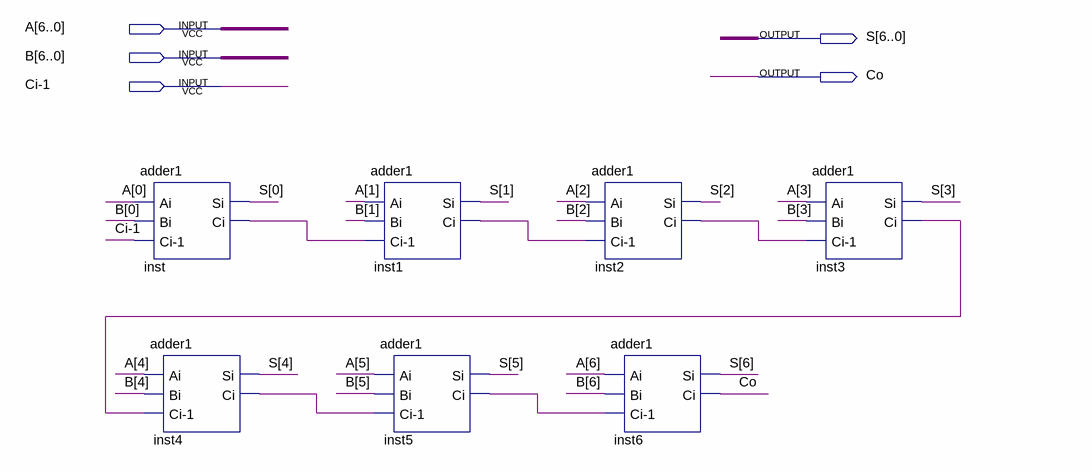
[diagram p0: schematic sheet]
// Quartus schematic adder7.bdf as structural Verilog: 7 symbols, 5 pins
module adder7 (
  input  [6:0] A,
  input  [6:0] B,
  input  \Ci-1 ,
  output [6:0] S,
  output Co
);

  wire inst1_ci, inst2_ci, inst3_ci, inst4_ci, inst5_ci, inst_ci;

  adder1 inst (.Ai(A[0]), .Bi(B[0]), .\Ci-1 (\Ci-1 ), .Si(S[0]), .Ci(inst_ci));
  adder1 inst4 (.Ai(A[4]), .Bi(B[4]), .\Ci-1 (inst3_ci), .Si(S[4]), .Ci(inst4_ci));
  adder1 inst1 (.Ai(A[1]), .Bi(B[1]), .\Ci-1 (inst_ci), .Si(S[1]), .Ci(inst1_ci));
  adder1 inst5 (.Ai(A[5]), .Bi(B[5]), .\Ci-1 (inst4_ci), .Si(S[5]), .Ci(inst5_ci));
  adder1 inst2 (.Ai(A[2]), .Bi(B[2]), .\Ci-1 (inst1_ci), .Si(S[2]), .Ci(inst2_ci));
  adder1 inst6 (.Ai(A[6]), .Bi(B[6]), .\Ci-1 (inst5_ci), .Si(S[6]), .Ci(Co));
  adder1 inst3 (.Ai(A[3]), .Bi(B[3]), .\Ci-1 (inst2_ci), .Si(S[3]), .Ci(inst3_ci));
endmodule
